# Altium schematic sheet new_topology.SchDoc
size A3
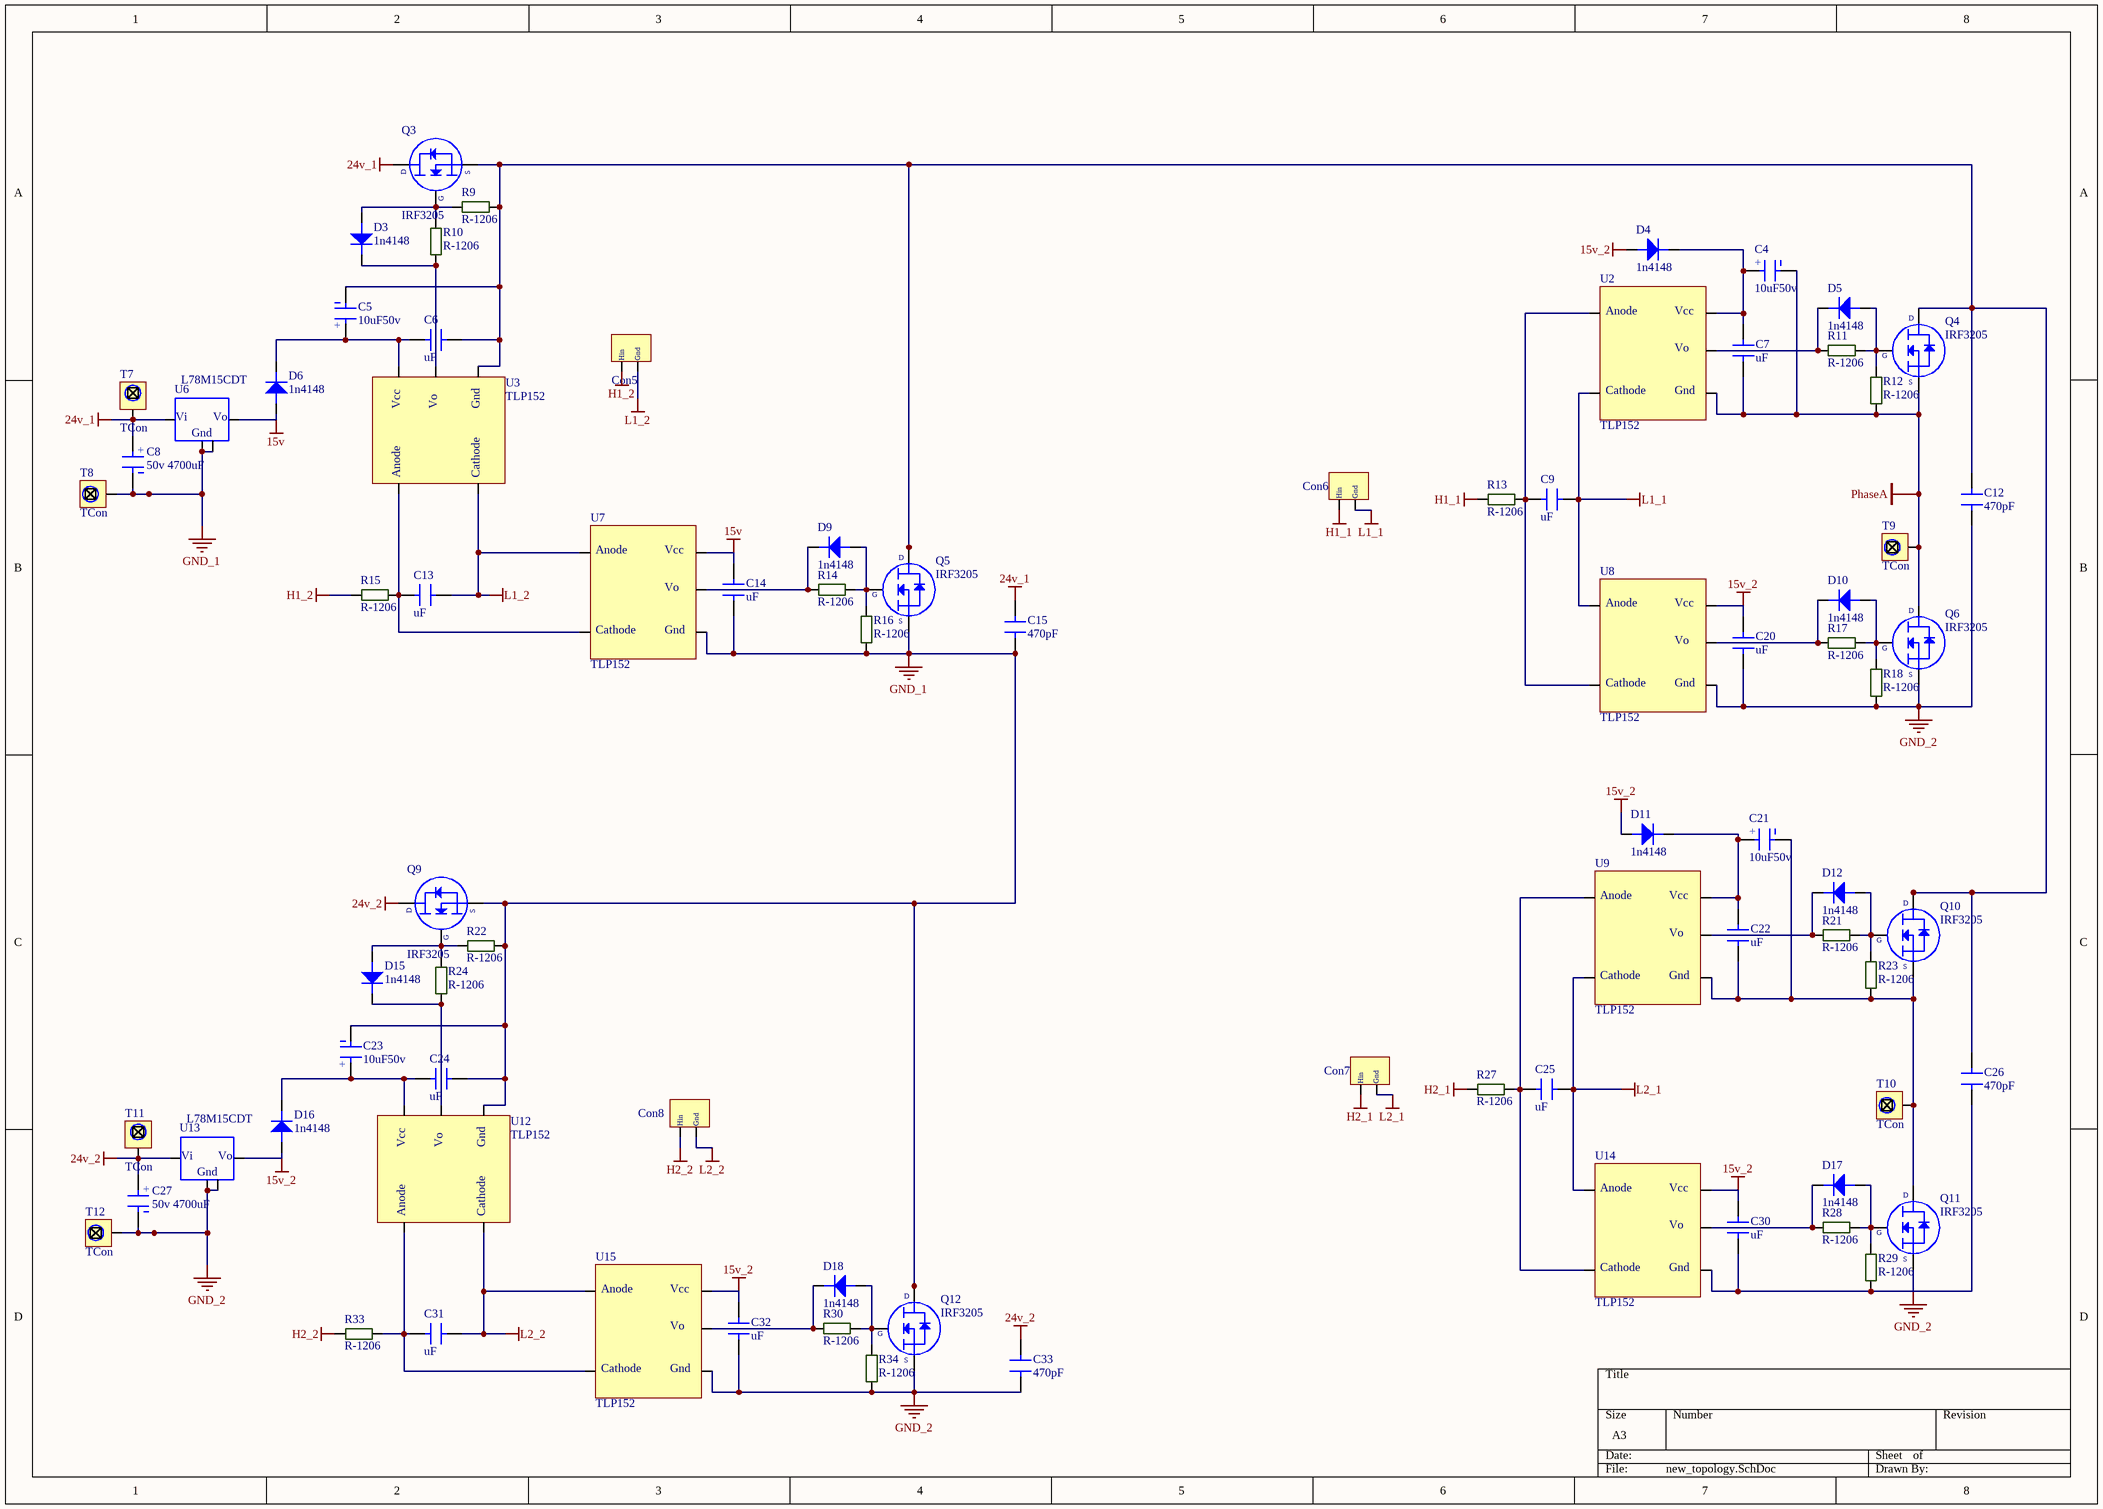
[diagram p0: new_topology.SchDoc]

## Parts
C4  10uF50v  [4x5.3 cap]
C5  10uF50v  [4x5.3 cap]
C6  uF  [C-1206]
C7  uF  [C-1206]
C8  50v 4700uF  [CAPPRD1000W190D2575H3200]
C9  uF  [C-1206]
C12  470pF  [100v 470pF]
C13  uF  [C-1206]
C14  uF  [C-1206]
C15  470pF  [100v 470pF]
C20  uF  [C-1206]
C21  10uF50v  [4x5.3 cap]
C22  uF  [C-1206]
C23  10uF50v  [4x5.3 cap]
C24  uF  [C-1206]
C25  uF  [C-1206]
C26  470pF  [100v 470pF]
C27  50v 4700uF  [CAPPRD1000W190D2575H3200]
C30  uF  [C-1206]
C31  uF  [C-1206]
C32  uF  [C-1206]
C33  470pF  [100v 470pF]
Con5  Connector2  [Conn]  (value not drawn)
Con6  Connector2  [Conn]  (value not drawn)
Con7  Connector2  [Conn]  (value not drawn)
Con8  Connector2  [Conn]  (value not drawn)
D3  1n4148  [SOD123]
D4  1n4148  [SOD123]
D5  1n4148  [SOD123]
D6  1n4148  [SOD123]
D9  1n4148  [SOD123]
D10  1n4148  [SOD123]
D11  1n4148  [SOD123]
D12  1n4148  [SOD123]
D15  1n4148  [SOD123]
D16  1n4148  [SOD123]
D17  1n4148  [SOD123]
D18  1n4148  [SOD123]
Q3  IRF3205  [DPAK_TO263]
Q4  IRF3205  [DPAK_TO263]
Q5  IRF3205  [DPAK_TO263]
Q6  IRF3205  [DPAK_TO263]
Q9  IRF3205  [DPAK_TO263]
Q10  IRF3205  [DPAK_TO263]
Q11  IRF3205  [DPAK_TO263]
Q12  IRF3205  [DPAK_TO263]
R9  R-1206  [R-1206]
R10  R-1206  [R-1206]
R11  R-1206  [R-1206]
R12  R-1206  [R-1206]
R13  R-1206  [R-1206]
R14  R-1206  [R-1206]
R15  R-1206  [R-1206]
R16  R-1206  [R-1206]
R17  R-1206  [R-1206]
R18  R-1206  [R-1206]
R21  R-1206  [R-1206]
R22  R-1206  [R-1206]
R23  R-1206  [R-1206]
R24  R-1206  [R-1206]
R27  R-1206  [R-1206]
R28  R-1206  [R-1206]
R29  R-1206  [R-1206]
R30  R-1206  [R-1206]
R33  R-1206  [R-1206]
R34  R-1206  [R-1206]
T7  TCon  [tCon]
T8  TCon  [tCon]
T9  TCon  [tCon]
T10  TCon  [tCon]
T11  TCon  [tCon]
T12  TCon  [tCon]
U2  TLP152  [TLP152]
U3  TLP152  [TLP152]
U6  L78M15CDT  [TO-252]
U7  TLP152  [TLP152]
U8  TLP152  [TLP152]
U9  TLP152  [TLP152]
U12  TLP152  [TLP152]
U13  L78M15CDT  [TO-252]
U14  TLP152  [TLP152]
U15  TLP152  [TLP152]

## Nets
15v: C14.2 D6.a U6.3 U7.5
15v_2: C20.2 C30.2 C32.2 D4.a D11.a D16.a U8.5 U13.3 U14.5 U15.5
24v_1: C8.2 C15.1 Q3.3 T7.1 U6.1
24v_2: C27.2 C33.1 Q9.3 T11.1 U13.1
GND_1: C8.1 C14.1 C15.2 C23.2 C24.1 Q5.2 Q9.2 Q12.3 R16.1 R22.1 T8.1 U6.2 U6.4 U7.3 U12.3
GND_2: C12.1 C20.1 C26.1 C27.1 C30.1 C32.1 C33.2 Q6.2 Q11.2 Q12.2 R18.1 R29.1 R34.1 T12.1 U8.3 U13.2 U13.4 U14.3 U15.3
H1_1: Con6.1 R13.1
H1_2: Con5.1 R15.1
H2_1: Con7.1 R27.1
H2_2: Con8.1 R33.1
L1_1: C9.2 Con6.2 U2.2 U8.1
L1_2: C13.2 Con5.2 U3.2 U7.1
L2_1: C25.2 Con7.2 U9.2 U14.1
L2_2: C31.2 Con8.2 U12.2 U15.1
PhaseA: C4.2 C7.1 Q4.2 Q6.3 R12.1 T9.1 U2.3
NetC4_1: C4.1 C7.2 D4.k U2.5
NetC5_1: C5.1 C6.2 D6.k U3.5
NetC5_2: C5.2 C6.1 C12.2 C26.2 Q3.2 Q4.3 Q5.3 Q10.3 R9.1 U3.3
NetC9_1: C9.1 R13.2 U2.1 U8.2
NetC13_1: C13.1 R15.2 U3.1 U7.2
NetC21_1: C21.1 C22.2 D11.k U9.5
NetC21_2: C21.2 C22.1 Q10.2 Q11.3 R23.1 T10.1 U9.3
NetC23_1: C23.1 C24.2 D16.k U12.5
NetC25_1: C25.1 R27.2 U9.1 U14.2
NetC31_1: C31.1 R33.2 U12.1 U15.2
NetD3_a: D3.a Q3.1 R9.2 R10.2
NetD3_k: D3.k R10.1 U3.4
NetD5_a: D5.a Q4.1 R11.2 R12.2
NetD5_k: D5.k R11.1 U2.4
NetD9_a: D9.a Q5.1 R14.2 R16.2
NetD9_k: D9.k R14.1 U7.4
NetD10_a: D10.a Q6.1 R17.2 R18.2
NetD10_k: D10.k R17.1 U8.4
NetD12_a: D12.a Q10.1 R21.2 R23.2
NetD12_k: D12.k R21.1 U9.4
NetD15_a: D15.a Q9.1 R22.2 R24.2
NetD15_k: D15.k R24.1 U12.4
NetD17_a: D17.a Q11.1 R28.2 R29.2
NetD17_k: D17.k R28.1 U14.4
NetD18_a: D18.a Q12.1 R30.2 R34.2
NetD18_k: D18.k R30.1 U15.4

## Notes on the sheet
- (in symbol Aluminum Electrolytic Capacitors) +
- (in symbol Connector2) Hin; Gnd
- (in symbol IRF3205STRLPBF) D; S; G
- (in symbol L78M15CDT) Vi; Vo; Gnd
- (in symbol TLP152(TPL,E) Anode; Vcc; Vo; Cathode; Gnd
- (in symbol UWD1H100MCL1GS) +

## Library data of the parts
C4 C5 C21 C23 = UWD1H100MCL1GS: Aluminum Electrolytic Capacitors - SMD 50volts 10uF 6.3x5.8; Manufacturer: Nichicon; Material: Aluminium; Voltage Rating: 50V; Tolerance: 20%; Ripple Current: 165mA; Impedance: 880mR; Leakage Current: 3uA; Life (Hours): 2000Hour; Dissipation Factor: 0.12%; Supplier 1: Digi-Key; Manufacturer Part Number: UWD1H100MCL1GS; RoHS: Yes; Stock 1: 8000; Pricing 1: 1000 = 0.23520, 2000 = 0.22050, 5000 = 0.20580, 10000 = 0.19845, 25000 = 0.19110, 50000 = 0.19040 (USD); Mount: Surface Mount; Case/Package: SMD/SMT; Min Operating Temperature: -55°C; Max Operating Temperature: 105°C; Package Quantity: 1; Capacitance: 10uF; Packaging: Tape and Reel; Voltage Rating (DC): 50V; Termination: SMD/SMT; Voltage: 50V; Features: General Purpose; Diameter: 6.3mm; Length: 5.8mm; Height: 5.8mm; Height - Seated (Max): 0.24inch; Lead Pitch: 2.2mm; Radiation Hardening: No; Lead Free: Lead Free; ComponentLink1URL: https://datasheet.ciiva.com/11783/0900766b8080ae55-11783196.pdf?src-supplier=RSComponents; ComponentLink1Description: https://datasheet.ciiva.com/11783/0900766b8080ae55-11783196.pdf?src-supplier=RSComponents; ComponentLink2URL: https://datasheet.ciiva.com/17526/e-wd-17526757.pdf?src-supplier=Avnet+Europe; ComponentLink2Description: https://datasheet.ciiva.com/17526/e-wd-17526757.pdf?src-supplier=Avnet+Europe; ComponentLink3URL: https://datasheet.ciiva.com/5362/e-wd-5362054.pdf?src-supplier=Mouser; ComponentLink3Description: https://datasheet.ciiva.com/5362/e-wd-5362054.pdf?src-supplier=Mouser; ComponentLink4URL: https://datasheet.ciiva.com/11686/e-wd-11686678.pdf?src-supplier=Avnet; ComponentLink4Description: https://datasheet.ciiva.com/11686/e-wd-11686678.pdf?src-supplier=Avnet; ComponentLink5URL: https://datasheet.ciiva.com/6310/e-wd-6310126.pdf?src-supplier=Digi-Key; ComponentLink5Description: https://datasheet.ciiva.com/6310/e-wd-6310126.pdf?src-supplier=Digi-Key; ComponentLink6URL: https://datasheet.ciiva.com/6310/e-wd-6310127.pdf?src-supplier=Digi-Key; ComponentLink6Description: https://datasheet.ciiva.com/6310/e-wd-6310127.pdf?src-supplier=Digi-Key; Supplier Part Number 1: 493-6294-2-ND
C6 C7 C9 C13 C14 C20 C22 C24 C25 C30-C32 = C-1206
C8 C27 = Aluminum Electrolytic Capacitors: PKL5-063V472MM450 Aluminum Electrolytic Capacitors - Snap In 63volts 4700uF 20%; Manufacturer: Nichicon; Manufacturer Part Number: LKS1J472MESZ; Capacitance: 4.7mF; Voltage Rating: 63V; Ripple Current: 3A; Life (Hours): 1000Hour; Supplier 1: Mouser; RoHS: Yes; Mount: Through Hole; Case/Package: Radial; Min Operating Temperature: -40°C; Max Operating Temperature: 85°C; Package Quantity: 250; Tolerance: 20%; Packaging: Bulk; Voltage Rating (DC): 63V; Termination: Snap in; Diameter: 22mm; Length: 45mm; Lead Pitch: 0.394inch; Height - Seated (Max): 1.772inch; Supplier Part Number 1: 647-LKS1J472MESZ; ComponentLink2Description: https://www.ozdisan.com/pasif-komponentler/kondansatorler/aluminyum-kondansatorler/PKL5-063V472MM450; ComponentLink2URL: https://www.ozdisan.com/pasif-komponentler/kondansatorler/aluminyum-kondansatorler/PKL5-063V472MM450
C12 C15 C26 C33 = 100v 470p cap
D3-D6 D9-D12 D15-D18 = 1N4148W-E3-18: Diode Small Signal Switching 100V 0.15A 2-Pin SOD-123 T/R; Manufacturer: Vishay; Recovery Time: 4ns; Max Power Dissipation: 350mW; Forward Current: 150mA; Max Surge Current: 2A; Forward Voltage: 1.2V; Max Reverse Leakage Current: 5uA; Element Configuration: Single; Max Reverse Voltage (DC): 75V; Peak Reverse Current: 100uA; Supplier 1: Allied Electronics; Manufacturer Part Number: 1N4148W-E3-18; RoHS: Yes; Stock 1: 6838; Pricing 1: 1 = 0.03900, 25 = 0.03800, 100 = 0.03600, 250 = 0.03400, 500 = 0.03200, 1000 = 0.03100, 2500 = 0.02900 (USD); Mount: Surface Mount; Number of Pins: 2; Weight: 0.000363oz; Contact Plating: Tin; Min Operating Temperature: -55°C; Max Operating Temperature: 150°C; Packaging: Tape and Reel; Package Quantity: 10000; Average Rectified Current: 150mA; Reverse Recovery Time: 4ns; Power Dissipation: 350mW; Max Repetitive Reverse Voltage (Vrrm): 100V; Peak Non-Repetitive Surge Current: 2A; Length: 2.85mm; Height: 1.25mm; Width: 1.7mm; Radiation Hardening: No; Lead Free: Lead Free; ComponentLink1URL: https://datasheet.ciiva.com/29885/1n4148w-29885941.pdf?src-supplier=Avnet; ComponentLink1Description: https://datasheet.ciiva.com/29885/1n4148w-29885941.pdf?src-supplier=Avnet; ComponentLink2URL: https://datasheet.ciiva.com/29593/1n4148w-29593113.pdf?src-supplier=Digi-Key; ComponentLink2Description: https://datasheet.ciiva.com/29593/1n4148w-29593113.pdf?src-supplier=Digi-Key; ComponentLink3URL: https://datasheet.ciiva.com/29593/1n4148w-29593111.pdf?src-supplier=Digi-Key; ComponentLink3Description: https://datasheet.ciiva.com/29593/1n4148w-29593111.pdf?src-supplier=Digi-Key; ComponentLink4URL: https://datasheet.ciiva.com/29593/1n4148w-29593112.pdf?src-supplier=Digi-Key; ComponentLink4Description: https://datasheet.ciiva.com/29593/1n4148w-29593112.pdf?src-supplier=Digi-Key; Supplier Part Number 1: 70061597
Q3-Q6 Q9-Q12 = IRF3205STRLPBF: MOSFET N-CH 55V 110A D2PAK; Manufacturer: Infineon; Rds On Max: 8mR; Input Capacitance: 3.247nF; Max Power Dissipation: 200W; Turn-Off Delay Time: 50ns; Turn-On Delay Time: 14ns; Gate to Source Voltage (Vgs): 20V; Threshold Voltage: 4V; Supplier 1: Digi-Key; Manufacturer Part Number: IRF3205STRLPBF; RoHS: Yes; Stock 1: 3281; Pricing 1: 1 = 1,84000, 10 = 1,66600, 100 = 1,33840 (USD); Mount: Surface Mount; Case/Package: D2PAK; Number of Pins: 3; Min Operating Temperature: -55°C; Max Operating Temperature: 175°C; Packaging: Cut Tape; Drain to Source Voltage (Vdss): 55V; Continuous Drain Current (ID): 110A; Power Dissipation: 200W; Drain to Source Resistance: 8mR; Drain to Source Breakdown Voltage: 55V; Length: 0.42inch; Height: 0.19inch; Width: 0.38inch; REACH SVHC: No SVHC; Lead Free: Lead Free; ComponentLink1URL: https://www.alliedelec.com/m/d/b8827ca43655240244f0cc5c2198e6b1.pdf?src-supplier=Allied+Electronics; ComponentLink1Description: https://www.alliedelec.com/m/d/b8827ca43655240244f0cc5c2198e6b1.pdf?src-supplier=Allied+Electronics; ComponentLink2URL: https://www.infineon.com/dgdl/irf3205spbf.pdf?fileId=5546d462533600a4015355defac9190c&src-supplier=Digi-Key; ComponentLink2Description: https://www.infineon.com/dgdl/irf3205spbf.pdf?fileId=5546d462533600a4015355defac9190c&src-supplier=Digi-Key; ComponentLink3URL: http://www.infineon.com/dgdl/irf3205spbf.pdf?fileId=5546d462533600a4015355defac9190c&src-supplier=Digi-Key; ComponentLink3Description: http://www.infineon.com/dgdl/irf3205spbf.pdf?fileId=5546d462533600a4015355defac9190c&src-supplier=Digi-Key; ComponentLink4URL: http://www.farnell.com/datasheets/1884183.pdf?src-supplier=Element14; ComponentLink4Description: http://www.farnell.com/datasheets/1884183.pdf?src-supplier=Element14; Supplier Part Number 1: IRF3205STRLPBFCT-ND
R9-R18 R21-R24 R27-R30 R33 R34 = R-1206: Res1206
T7-T12 = Terminal Connector: ComponentLink1Description: https://www.ozdisan.com/konnektor-baglanti-elemanlari/terminal-konnektorler/vida-tipi-konnektorler/K36-00AH; ComponentLink1URL: https://www.ozdisan.com/konnektor-baglanti-elemanlari/terminal-konnektorler/vida-tipi-konnektorler/K36-00AH
U2 U3 U7-U9 U12 U14 U15 = TLP152(TPL,E: OPTOISO 3.75KV GATE DRIVER 6SO-5; Manufacturer: Toshiba; Number of Channels: 1; Propagation Delay: 165ns; Max Power Dissipation: 260mW; Direction: Unidirectional; Turn-On Delay Time: 190ns; Fall Time: 22ns; Forward Voltage: 1.57V; Output Current: 2.5A; Forward Current: 10mA; Rise Time: 18ns; High Level Output Current: 2A; Pulse Width Distortion (PWD): 50ns; Supplier 1: Mouser; Manufacturer Part Number: TLP152(TPL,E; RoHS: Yes; Stock 1: 22321; Pricing 1: 1 = 1.55000, 10 = 0.96800, 50 = 0.96800, 100 = 0.87200, 1000 = 0.54300, 10000 = 0.44000 (USD); Mount: Surface Mount; Case/Package: SO; Number of Pins: 5; Min Operating Temperature: -40°C; Max Operating Temperature: 100°C; Packaging: Tape and Reel; Package Quantity: 3000; Low Level Output Current: 2A; Max Output Current: 2.5A; ComponentLink1URL: https://datasheet.ciiva.com/41848/tlp152-datasheet-en-20120914-41848928.pdf?src-supplier=Digi-Key; ComponentLink1Description: https://datasheet.ciiva.com/41848/tlp152-datasheet-en-20120914-41848928.pdf?src-supplier=Digi-Key; Supplier Part Number 1: 757-TLP152TPLE
U6 U13 = L78M15CDT: Linear Voltage Regulators 15V 0.5A Positive; Manufacturer: STMicroelectronics; Max Output Current: 500mA; Number of Outputs: 1; Max Input Voltage: 35V; Quiescent Current: 6mA; Output Type: Fixed; Dropout Voltage: 2V; Supplier 1: Avnet; Manufacturer Part Number: L78M15CDT; RoHS: Yes; Mount: Surface Mount; Case/Package: DPAK; Number of Pins: 3; Min Operating Temperature: 0°C; Max Operating Temperature: 150°C; Output Voltage: 15V; Polarity: Positive; Packaging: Rail/Tube; Output Current: 500mA; Min Input Voltage: 35V; Package Quantity: 75; Length: 6.6mm; Height: 2.4mm; Width: 6.2mm; Radiation Hardening: No; ComponentLink1URL: http://docs-usa.electrocomponents.com/techlib:/itc_doclist_US.htm?stockno=1890999&src-supplier=Allied+Electronics; ComponentLink1Description: http://docs-usa.electrocomponents.com/techlib:/itc_doclist_US.htm?stockno=1890999&src-supplier=Allied+Electronics; ComponentLink2URL: http://www.st.com/web/en/resource/technical/document/datasheet/CD00000447.pdf?src-supplier=Avnet+Europe; ComponentLink2Description: http://www.st.com/web/en/resource/technical/document/datasheet/CD00000447.pdf?src-supplier=Avnet+Europe; ComponentLink3URL: http://www.mouser.com/ds/2/389/stmicroelectronics_cd00000447-329548.pdf?src-supplier=Mouser; ComponentLink3Description: http://www.mouser.com/ds/2/389/stmicroelectronics_cd00000447-329548.pdf?src-supplier=Mouser; Supplier Part Number 1: L78M15CDT
Con5-Con8 = Connector2: System: Connector